# Altium schematic sheet Inputs.SchDoc
size A4; SheetNumber: 3; SheetTotal: 4
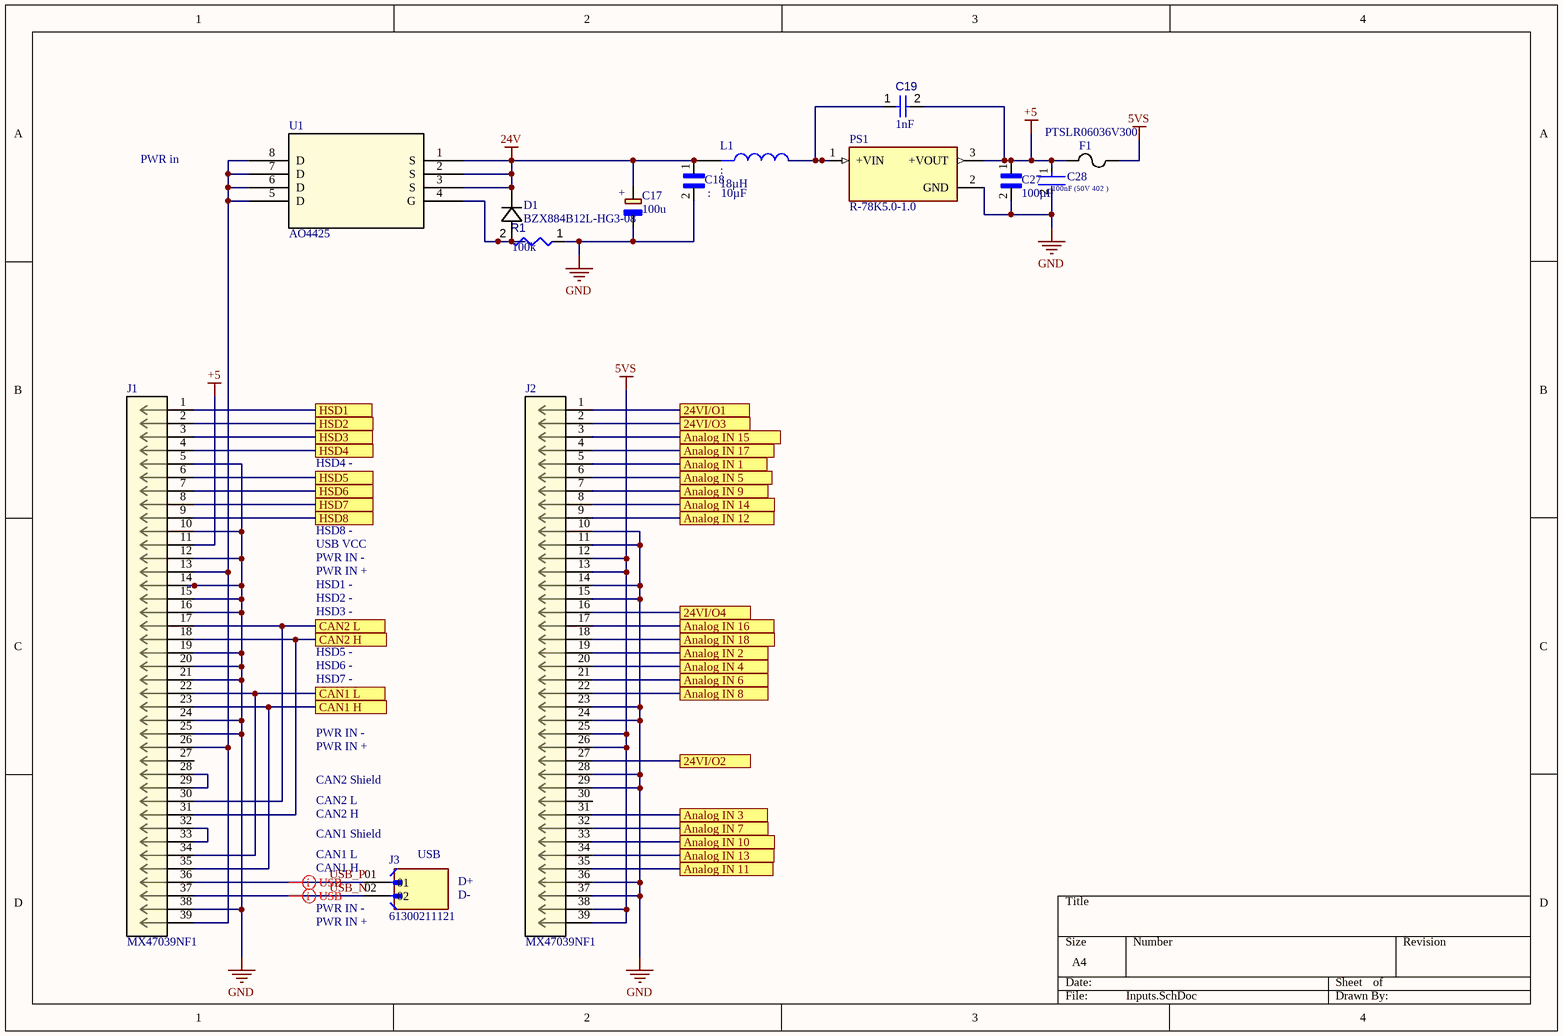
[diagram p0: Inputs.SchDoc]

## Parts
C17  value 100u  [865080445010]  (hidden comment: 865080545012)
C18  value 10µF  [CAPC2012X145N]  (hidden comment: GRM21BR61H106KE43L)
C19  value 1nF  [CAPC0402(1005)33_L]  (hidden comment: Capacitor 1nF +/-20% 50V 0402)
C27  value 100µF  [CAPC3216X190N]  (hidden comment: GRM31CR61A107MEA8L)
C28  100nF (50V 402 )  [FP-CL779-IPC_C]
D1  BZX884B12L-HG3-08  [CR_9V1L-HG3-08_VIS]
F1  PTSLR06036V300  [FUSE_PTSLR06036V300_EAT]
J1  MX47039NF1  [CONN39_MX47039_JAE]
J2  MX47039NF1  [CONN39_MX47039_JAE]
J3  61300211121  [WURTH_61300211121]
L1  value 18µH  [IND_RLS-186]  (hidden comment: RLS-186)
PS1  R-78K5.0-1.0  [CONV_R-78K5.0-1.0]
R1  value 100k  [RESC0402(1005)_L]  (hidden comment: Resistor 100K +/-1 % 0402 63 mW)
U1  AO4425  [SO-8_AOS]

## Ports
24VI/O1, 24VI/O2, 24VI/O3, 24VI/O4, Analog IN 1, Analog IN 2, Analog IN 3, Analog IN 4, Analog IN 5, Analog IN 6, Analog IN 7, Analog IN 8, Analog IN 9, Analog IN 10, Analog IN 11, Analog IN 12, Analog IN 13, Analog IN 14, Analog IN 15, Analog IN 16, Analog IN 17, Analog IN 18, CAN1 H, CAN1 L, CAN2 H, CAN2 L, HSD1, HSD2, HSD3, HSD4, HSD5, HSD6, HSD7, HSD8

## Nets
5VS: F1.2 J2.12 J2.13 J2.25 J2.26 J2.38 J2.39
24V: C17.POS C18.1 D1.1 L1.1 U1.1(S) U1.2(S) U1.3(S)
+5: C19.2 C27.1 C28.1 F1.1 J1.11 PS1.3(+VOUT)
GND: C17.NEG C18.2 C27.2 C28.2 J1.5 J1.10 J1.12 J1.14 J1.15 J1.16 J1.19 J1.20 J1.21 J1.24 J1.25 J1.38 J2.10 J2.11 J2.14 J2.15 J2.23 J2.24 J2.28 J2.29 J2.36 J2.37 PS1.2(GND) R1.1
24VI/O1: J2.1 ; port 24VI/O1
24VI/O2: J2.27 ; port 24VI/O2
24VI/O3: J2.2 ; port 24VI/O3
24VI/O4: J2.16 ; port 24VI/O4
Analog IN 1: J2.5 ; port Analog IN 1
Analog IN 2: J2.19 ; port Analog IN 2
Analog IN 3: J2.31 ; port Analog IN 3
Analog IN 4: J2.20 ; port Analog IN 4
Analog IN 5: J2.6 ; port Analog IN 5
Analog IN 6: J2.21 ; port Analog IN 6
Analog IN 7: J2.32 ; port Analog IN 7
Analog IN 8: J2.22 ; port Analog IN 8
Analog IN 9: J2.7 ; port Analog IN 9
Analog IN 10: J2.33 ; port Analog IN 10
Analog IN 11: J2.35 ; port Analog IN 11
Analog IN 12: J2.9 ; port Analog IN 12
Analog IN 13: J2.34 ; port Analog IN 13
Analog IN 14: J2.8 ; port Analog IN 14
Analog IN 15: J2.3 ; port Analog IN 15
Analog IN 16: J2.17 ; port Analog IN 16
Analog IN 17: J2.4 ; port Analog IN 17
Analog IN 18: J2.18 ; port Analog IN 18
CAN1 H: J1.23 J1.35 ; port CAN1 H
CAN1 L: J1.22 J1.34 ; port CAN1 L
CAN2 H: J1.18 J1.31 ; port CAN2 H
CAN2 L: J1.17 J1.30 ; port CAN2 L
HSD1: J1.1 ; port HSD1
HSD2: J1.2 ; port HSD2
HSD3: J1.3 ; port HSD3
HSD4: J1.4 ; port HSD4
HSD5: J1.6 ; port HSD5
HSD6: J1.7 ; port HSD6
HSD7: J1.8 ; port HSD7
HSD8: J1.9 ; port HSD8
USB_N: J1.37 J3.02
USB_P: J1.36 J3.01
NetC19_1: C19.1 L1.2 PS1.1(+VIN)
NetD1_2: D1.2 R1.2 U1.4(G)
NetJ1_13: J1.13 J1.26 J1.39 U1.5(D) U1.6(D) U1.7(D) U1.8(D)
NetJ1_28: J1.28 J1.29
NetJ1_32: J1.32 J1.33

Not connected (* = marked no-connect by the designer): J1 27; J2 30

## Layout directives
differential pair: USB_P
differential pair; rule Clearance Constraint [Generic clearance = 10mil, and 12 value(s) for objects]; rule Width Constraint [Pref Width = 10mil    Min Width = 10mil    Max Width = 10mil]: USB_N

## Notes on the sheet
- PWR in
- HSD4 -
- HSD8 -
- USB VCC
- PWR IN +
- PWR IN -
- HSD1 -
- HSD3 -
- HSD5 -
- HSD2 -
- HSD7 -
- HSD6 -
- CAN2 Shield
- (near J3) CAN1 Shield
- CAN2 L
- CAN2 H
- (near J3) PWR IN -
- (near J3) PWR IN +
- (near J3) CAN1 L
- (near J3) CAN1 H
- (near J3) USB
- D+
- D-
- (in symbol CMP-174-000000-1) +

## Library data of the parts
C17 = CMP-174-000000-1: 100 ÂµF 35 V Aluminum Electrolytic Capacitors Radial, Can - SMD - 2000 Hrs @ 105Â°C; MF: WÃ¼rth Elektronik; Source: 865080545012.SchLib; Pin Count: 2; Purchase-URL: https://pricing.snapeda.com/search/part/865080545012/?ref=eda; Check_prices: https://www.snapeda.com/parts/865080545012/Wurth+Elektronik/view-part/?ref=eda; SnapEDA_Link: https://www.snapeda.com/parts/865080545012/Wurth+Elektronik/view-part/?ref=snap; Price: None; Design Item ID: 865080545012; Package: Radial WÃ¼rth Elektronik; Availability: In Stock; MP: 865080545012; Component Type: Standard
C18 = CMP-001-00102-1: SMD capacitor X5R(EIA) with capacitance 10uF Tol.10%. Rated voltage 50Vdc 85C; MF: Murata Electronics; SnapEDA_Link: https://www.snapeda.com/parts/GRM21BR61H106KE43L/Murata/view-part/4467420/?ref=snap; MP: GRM21BR61H106KE43L; Mouser-Purchase-URL: https://snapeda.com/shop?store=Mouser&id=4467420; Availability: Warning; Pins: 2; DigiKey-Purchase-URL: https://snapeda.com/shop?store=DigiKey&id=4467420; Price: None; Design Item ID: GRM21BR61H106KE43L; Case/Package: 2012 Murata; Source: GRM21BR61H106KE43L.SchLib; Component Type: Standard
C19 = CMP-001-00066-3: Chip Capacitor, 1nF +/-20%, 50V, 0402, Thickness 0.33 mm; Tolerance: 10%; Case/Package: 0402; Pins: 2; Min Operating Temperature: -55°C; Max Operating Temperature: 85°C; Voltage Rating: 50V; Mounting Technology: SMT
C27 = CMP-001-00109-1: Source: GRM31CR61A107MEA8L.SchLib; Price: None; Availability: Unavailable; Design Item ID: GRM31CR61A107MEA8L; Component Type: Standard; Pins: 2; Case/Package: None; MP: GRM31CR61A107MEA8L
C28 = CMP-13271-002336-1: Cap Ceramic 100nF 50V X7R ±10% SMD 0402 +125°C Paper T/R
D1 = CMP-122-000001-1: No Description Available; Mfr_Name: Vishay; Type: DEV; Design Item ID: BZX884B12L-HG3-08; RefDes: RefDes; Manufacturer_Part_Number: BZX884B12L-HG3-08; Source: BZX884B12L-HG3-08.SchLib; Copyright: Copyright (C) 2023 Ultra Librarian. All rights reserved.
F1 = CMP-005-00022-2: No Description Available; Mfr_Name: Eaton; Type: DEV; Design Item ID: PTSLR06036V300; Copyright: Copyright (C) 2023 Ultra Librarian. All rights reserved.; Source: PTSLR06036V300.SchLib; RefDes: RefDes; Manufacturer_Part_Number: PTSLR06036V300
J1 J2 = CMP-208-000000-6: No Description Available; Mfr_Name: JAE Electronics; Source: MX47039NF1.SchLib; Copyright: Copyright (C) 2023 Ultra Librarian. All rights reserved.; Type: DEV; Design Item ID: MX47039NF1; RefDes: RefDes; Manufacturer_Part_Number: MX47039NF1
J3 = CMP-002-00083-1: Connector Header Through Hole 2 position 0.100 (2.54mm); MF: Wurth Electronics; Pins: 2; Case/Package: None; Component Type: Standard; Source: 61300211121.SchLib; Design Item ID: 61300211121; SnapEDA_Link: https://www.snapeda.com/parts/61300211121/Wurth+Electronics+Inc./view-part/?ref=snap; MP: 61300211121; Check_prices: https://www.snapeda.com/parts/61300211121/Wurth+Electronics+Inc./view-part/?ref=eda; Value: *
L1 = CMP-006-00026-1: Line Inductors for RECOM Power Supply; Price: None; Pins: 2; MP: RLS-186; Design Item ID: RLS-186; Mouser-Purchase-URL: https://snapeda.com/shop?store=Mouser&id=3641538; SnapEDA_Link: https://www.snapeda.com/parts/RLS-186/Recom%20Power/view-part/3641538/?ref=snap; Arrow_Electronics-Purchase-URL: https://snapeda.com/shop?store=Arrow+Electronics&id=3641538; Case/Package: Nonstandard Recom Power; Component Type: Standard; Availability: Bad; MF: Recom Power; DigiKey-Purchase-URL: https://snapeda.com/shop?store=DigiKey&id=3641538; Source: RLS-186.SchLib
PS1 = CMP-009-00200-1: 1A DC/DC-Converter 'INNOLINE' SIP3 reg; Value: 5; MF: Recom Power; Purchase-URL: https://pricing.snapeda.com/search/part/R-78K5.0-1.0/?ref=eda; Price: None; Source: R-78K5.0-1.0.SchLib; Design Item ID: R-78K5.0-1.0; SnapEDA_Link: https://www.snapeda.com/parts/R-78K5.0-1.0/Recom+Power/view-part/?ref=snap; Pins: 3; MP: R-78K5.0-1.0; Availability: In Stock; Case/Package: None; Check_prices: https://www.snapeda.com/parts/R-78K5.0-1.0/Recom+Power/view-part/?ref=eda; Component Type: Standard
R1 = CMP-009-00168-3: Chip Resistor, 100 kOhms, +/-1 %, 63 mW, -55 to 155 degC, 0402; Tolerance: 1%; Power: 63mW; Max Operating Temperature: 155°C; Min Operating Temperature: -55°C; Pins: 2; Case/Package: 0402
U1 = CMP-119-000000-1: No Description Available; Mfr_Name: Alpha and Omega Semiconductor; Design Item ID: AO4425; RefDes: RefDes; Type: DEV; Manufacturer_Part_Number: AO4425; Copyright: Copyright (C) 2023 Ultra Librarian. All rights reserved.; Source: AO4286.SchLib